# EAGLE design AtMEGA32u4-uSD-AddON-v01 (EAGLE 5.11)
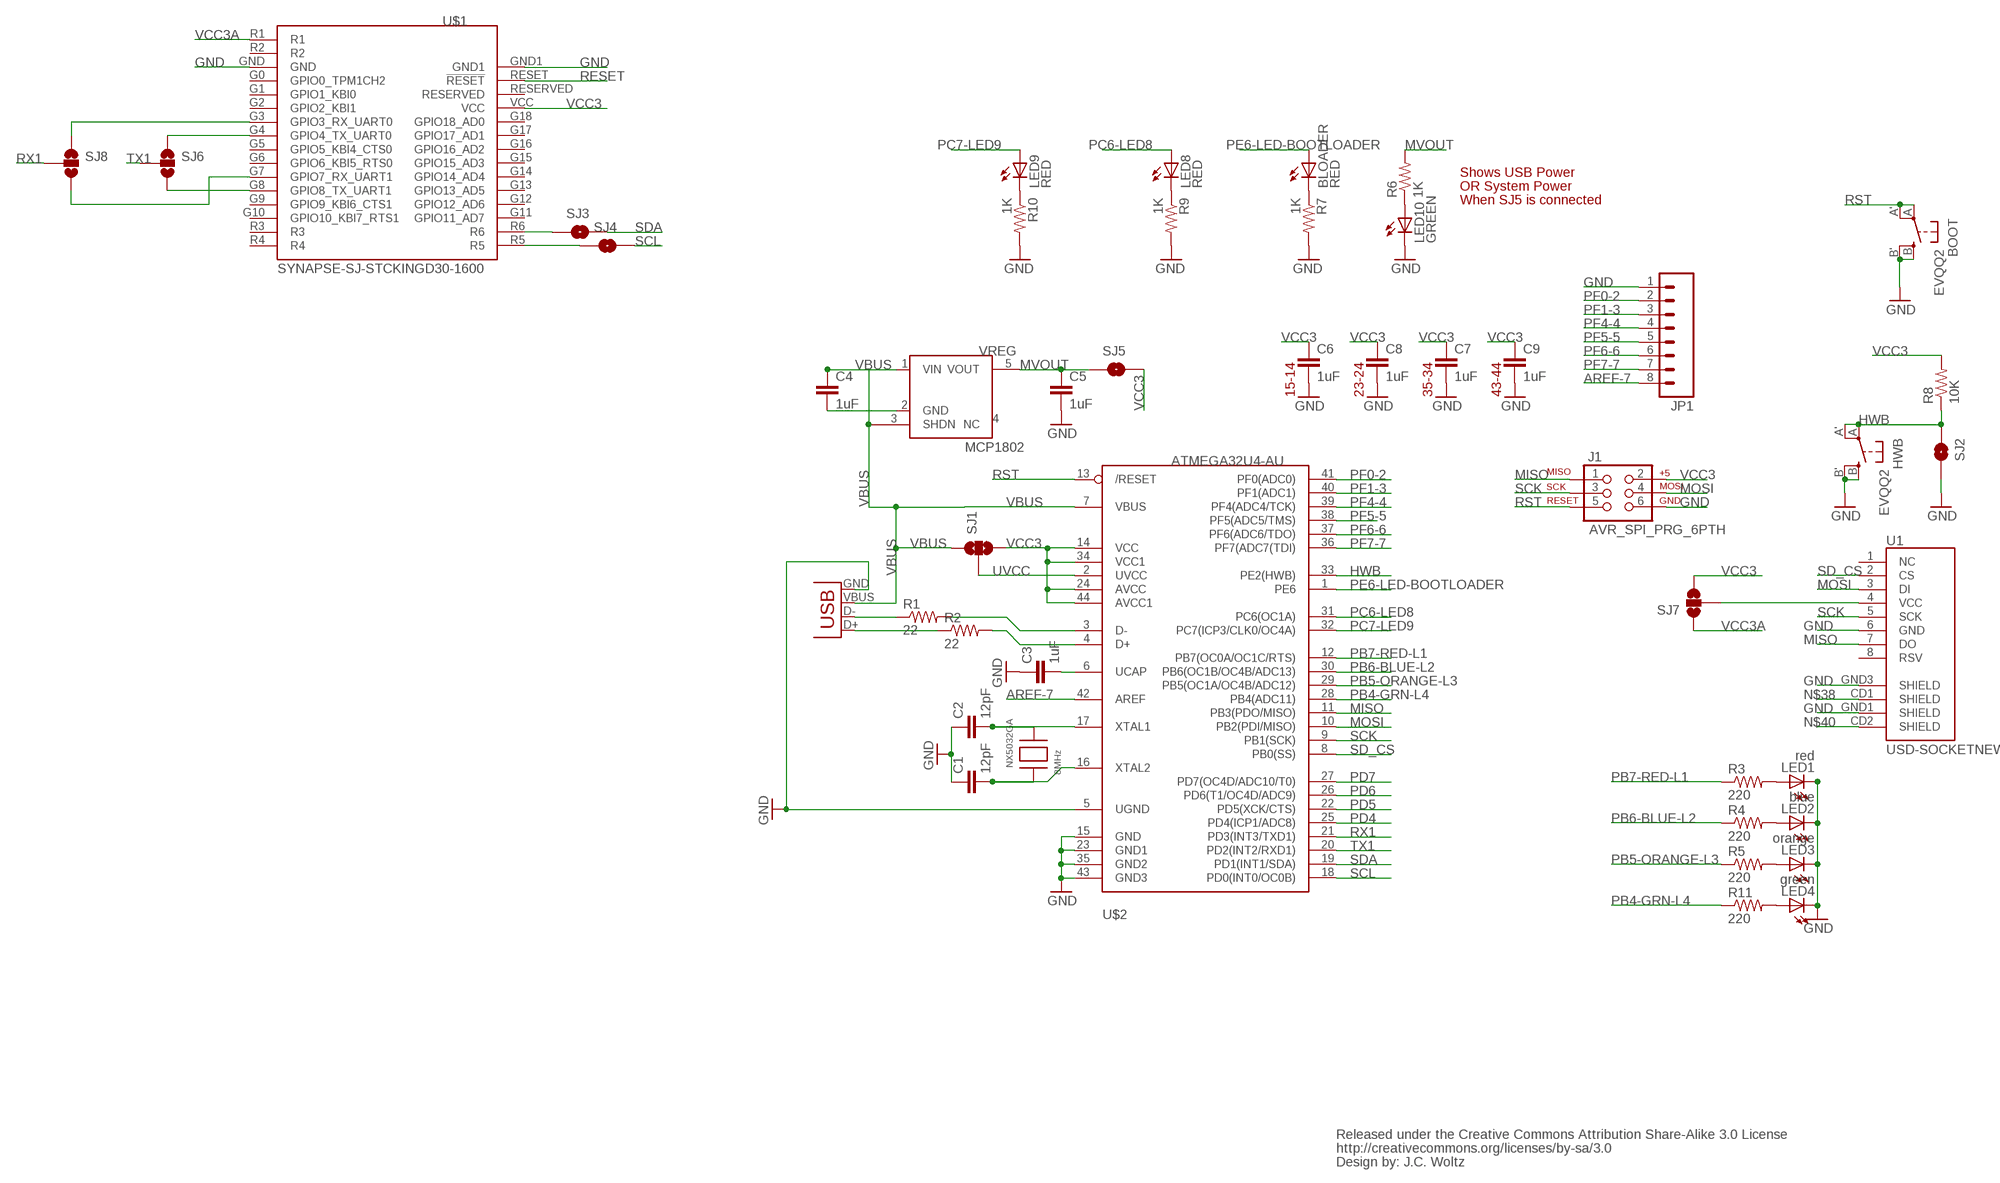
[diagram p0: schematic, sheet 1]

## Parts
BLOADER  RED  LED0603  [LED-0603]
BOOT  EVQQ2  [EVQ-Q2]
C1  12pF  CAP0603-CAP  [0603-CAP]
C2  12pF  CAP0603-CAP  [0603-CAP]
C3  1uF  CAP0603-CAP  [0603-CAP]
C4  1uF  CAP0603-CAP  [0603-CAP]
C5  1uF  CAP0603-CAP  [0603-CAP]
C6  1uF  CAP0603-CAP  [0603-CAP]
C7  1uF  CAP0603-CAP  [0603-CAP]
C8  1uF  CAP0603-CAP  [0603-CAP]
C9  1uF  CAP0603-CAP  [0603-CAP]
HWB  EVQQ2  [EVQ-Q2]
J1  AVR_SPI_PRG_6PTH  [2X3]
JP1  M08  [1X08]
LED1  red  LED0603  [LED-0603]
LED2  blue  LED0603  [LED-0603]
LED3  orange  LED0603  [LED-0603]
LED4  green  LED0603  [LED-0603]
LED8  RED  LED0603  [LED-0603]
LED9  RED  LED0603  [LED-0603]
LED10  GREEN  LED0603  [LED-0603]
NX5032GA  8MHz  XTALNX5032  [NX5032]
R1  22  RESISTOR0603-RES  [0603-RES]
R2  22  RESISTOR0603-RES  [0603-RES]
R3  220  RESISTOR0603-RES  [0603-RES]
R4  220  RESISTOR0603-RES  [0603-RES]
R5  220  RESISTOR0603-RES  [0603-RES]
R6  1K  RESISTOR0603-RES  [0603-RES]
R7  1K  RESISTOR0603-RES  [0603-RES]
R8  10K  RESISTOR0603-RES  [0603-RES]
R9  1K  RESISTOR0603-RES  [0603-RES]
R10  1K  RESISTOR0603-RES  [0603-RES]
R11  220  RESISTOR0603-RES  [0603-RES]
SJ1  SOLDERJUMPER_2WAYPASTE2&3  [SJ_3_PASTE2&3]
SJ2  HWB  SOLDERJUMPERNO  [SJ_2S-NO]
SJ3  SOLDERJUMPERNO  [SJ_2S-NO]
SJ4  SOLDERJUMPERNO  [SJ_2S-NO]
SJ5  SOLDERJUMPERNO  [SJ_2S-NO]
SJ6  SOLDERJUMPER_2WAYPASTE1&2  [SJ_3_PASTE1&2]
SJ7  SOLDERJUMPER_2WAYPASTE1&2  [SJ_3_PASTE1&2]
SJ8  SOLDERJUMPER_2WAYPASTE1&2  [SJ_3_PASTE1&2]
U1  USD-SOCKETNEW  [MICRO-SD-SOCKET-PP]
U$1  SYNAPSE-SJ-STCKINGD30-1600  [SYNSJ-STACK]
U$2  ATMEGA32U4-AU  [TQFP44]
U$5  CREATIVE_COMMONS  [CREATIVE_COMMONS]
VREG  MCP1802  [SOT23-5]
X1  USBSMD  USBH2959CT-ND  [USB-MINIB]

## Nets
AREF-7: JP1.8 U$2.42(AREF)
GND: BOOT.B'(S1) BOOT.B(S) C1.1 C2.1 C3.1 C4.2 C5.2 C6.2 C7.2 C8.2 C9.2 HWB.B'(S1) HWB.B(S) J1.6 JP1.1 LED1.C LED2.C LED3.C LED4.C LED10.C R7.2 R9.2 R10.2 SJ2.2 U1.6(GND) U1.GND1(SHIELD) U1.GND3(SHIELD) U$1.GND U$1.GND1 U$2.5(UGND) U$2.15(GND) U$2.23(GND1) U$2.35(GND2) U$2.43(GND3) VREG.2(GND) X1.GND
HWB [smallsignal]: HWB.A'(P1) HWB.A(P) R8.1 SJ2.1 U$2.33(PE2(HWB))
MISO: J1.1 U1.7(DO) U$2.11(PB3(PDO/MISO))
MOSI: J1.4 U1.3(DI) U$2.10(PB2(PDI/MISO))
MVOUT: C5.1 R6.2 SJ5.1 VREG.5(VOUT)
N$1: LED9.C R10.1
N$2: LED1.A R3.2
N$3: SJ7.2 U1.4(VCC)
N$4: C3.2 U$2.6(UCAP)
N$5: LED4.A R11.2
N$7: LED2.A R4.2
N$8: LED10.A R6.1
N$9: LED8.C R9.1
N$10: BLOADER.C R7.1
N$11: SJ3.1 U$1.R6
N$12: LED3.A R5.2
N$13: SJ4.1 U$1.R5
N$14: SJ8.1 U$1.G3(GPIO3_RX_UART0)
N$15: SJ6.1 U$1.G4(GPIO4_TX_UART0)
N$16: SJ8.3 U$1.G7(GPIO7_RX_UART1)
N$17: SJ6.3 U$1.G8(GPIO8_TX_UART1)
N$38: U1.CD1(SHIELD)
N$40: U1.CD2(SHIELD)
PB4-GRN-L4: R11.1 U$2.28(PB4(ADC11))
PB5-ORANGE-L3: R5.1 U$2.29(PB5(OC1A/OC4B/ADC12))
PB6-BLUE-L2: R4.1 U$2.30(PB6(OC1B/OC4B/ADC13))
PB7-RED-L1: R3.1 U$2.12(PB7(OC0A/OC1C/RTS))
PC6-LED8: LED8.A U$2.31(PC6(OC1A))
PC7-LED9: LED9.A U$2.32(PC7(ICP3/CLK0/OC4A))
PD4: U$2.25(PD4(ICP1/ADC8))
PD5: U$2.22(PD5(XCK/CTS))
PD6: U$2.26(PD6(T1/OC4D/ADC9))
PD7: U$2.27(PD7(OC4D/ADC10/T0))
PE6-LED-BOOTLOADER: BLOADER.A U$2.1(PE6)
PF0-2: JP1.2 U$2.41(PF0(ADC0))
PF1-3: JP1.3 U$2.40(PF1(ADC1))
PF4-4: JP1.4 U$2.39(PF4(ADC4/TCK))
PF5-5: JP1.5 U$2.38(PF5(ADC5/TMS))
PF6-6: JP1.6 U$2.37(PF6(ADC6/TDO))
PF7-7: JP1.7 U$2.36(PF7(ADC7(TDI))
RESET: U$1.RESET(!RESET)
RST [smallsignal]: BOOT.A'(P1) BOOT.A(P) J1.5 U$2.13(/RESET)
RX1: SJ8.2 U$2.21(PD3(INT3/TXD1))
SCK: J1.3 U1.5(SCK) U$2.9(PB1(SCK))
SCL: SJ4.2 U$2.18(PD0(INT0/OC0B))
SD_CS: U1.2(CS) U$2.8(PB0(SS))
SDA: SJ3.2 U$2.19(PD1(INT1/SDA))
TX1: SJ6.2 U$2.20(PD2(INT2/RXD1))
UD+: R2.2 U$2.4(D+)
UD-: R1.2 U$2.3(D-)
UDM: R1.1 X1.D-
UDP: R2.1 X1.D+
UVCC: SJ1.2 U$2.2(UVCC)
VBUS: C4.1 SJ1.1 U$2.7(VBUS) VREG.1(VIN) VREG.3(SHDN) X1.VBUS
VCC3: C6.1 C7.1 C8.1 C9.1 J1.2 R8.2 SJ1.3 SJ5.2 SJ7.3 U$1.VCC U$2.14(VCC) U$2.24(AVCC) U$2.34(VCC1) U$2.44(AVCC1)
VCC3A: SJ7.1 U$1.R1
XTAL1: C2.2 NX5032GA.P$2 U$2.17(XTAL1)
XTAL2: C1.2 NX5032GA.P$1 U$2.16(XTAL2)
Unconnected: U1.1(NC) U1.8(RSV) U$1.G0(GPIO0_TPM1CH2) U$1.G1(GPIO1_KBI0) U$1.G2(GPIO2_KBI1) U$1.G5(GPIO5_KBI4_CTS0) U$1.G6(GPIO6_KBI5_RTS0) U$1.G9(GPIO9_KBI6_CTS1) U$1.G10(GPIO10_KBI7_RTS1) U$1.G11(GPIO11_AD7) U$1.G12(GPIO12_AD6) U$1.G13(GPIO13_AD5) U$1.G14(GPIO14_AD4) U$1.G15(GPIO15_AD3) U$1.G16(GPIO16_AD2) U$1.G17(GPIO17_AD1) U$1.G18(GPIO18_AD0) U$1.R2 U$1.R3 U$1.R4 U$1.RESERVED VREG.4(NC)

## Notes on the sheet
- Shows USB Power
- OR System Power
- When SJ5 is connected
- 15-14 | 23-24 | 35-34 | 43-44

## Library data of the parts
BLOADER LED1-LED4 LED8-LED10 = 0_jc-custom:LED: LEDs Standard schematic elements and footprints for 5mm, 3mm, 1206, and 0603 sized LEDs. 5mm - Spark Fun Electronics SKU : COM-00529 (and others)
BOOT HWB = adaprog:EVQQ2
C1 C2 = SparkFun:CAP: Capacitor Standard 0603 ceramic capacitor, and 0.1" leaded capacitor.
C3-C9 = 0_jc-custom:CAP: Capacitor Standard 0603 ceramic capacitor, and 0.1" leaded capacitor.
J1 = SparkFun:AVR_SPI_PRG_6: AVR ISP 6 Pin This is the reduced ISP connector for AVR programming. Common on Arduino. This footprint will take up less PCB space and can be used with a 10-pin to 6-pin adapter such as SKU: BOB-08508
JP1 = SparkFun:M08: Header 8 Standard 8-pin 0.1" header. Use with straight break away headers (SKU : PRT-00116), right angle break away headers (PRT-00553), swiss pins (PRT-00743), machine pins (PRT-00117), and female headers (PRT-00115).
NX5032GA = adafruit:XTAL: Low cost SMT crystals, no capacitors included http://www.ladyada.net/library/eagle
R1-R11 = 0_jc-custom:RESISTOR
SJ1 SJ6-SJ8 = SparkFun:SOLDERJUMPER_2WAY: Solder Jumper 2 way solder jumper
SJ2-SJ5 = SparkFun:SOLDERJUMPER: Solder Jumper Standard SMD solder jumper. Used to automate production. Two varients : Normally Open and Normally Closed are the same, but have different paste layers. NC will have a large amount of paste and should jumper during reflow.
U1 = 0_jc-modified:USD-SOCKET: microSD Socket Push-push type uSD socket. Schematic element and footprint production proven. Spark Fun Electronics SKU : PRT-00127. tDoc lines correctly indicate media card edge positions when inserting (unlocked, locked, depressed).
U$1 = 0_jc-custom:SYNAPSE-SJ-STCKING: Standard layout for expansion modules using Synapse Wireless boards
U$2 = adafruit:ATMEGA32U4: http://www.ladyada.net/library/eagle
U$5 = 0_jc-custom:CREATIVE_COMMONS
VREG = 0_jc-custom:MCP1802
X1 = 0_jc-custom:USB: USB Connectors Fully proven 670-1190-1-ND http://search.digikey.com/scripts/DkSearch/dksus.dll?Detail&name=670-1190-1-ND

## Net classes
0 default: width 0.203 mm
1 smallsignal: width 0.152 mm
2 bigsignal: width 0.356 mm

## Board
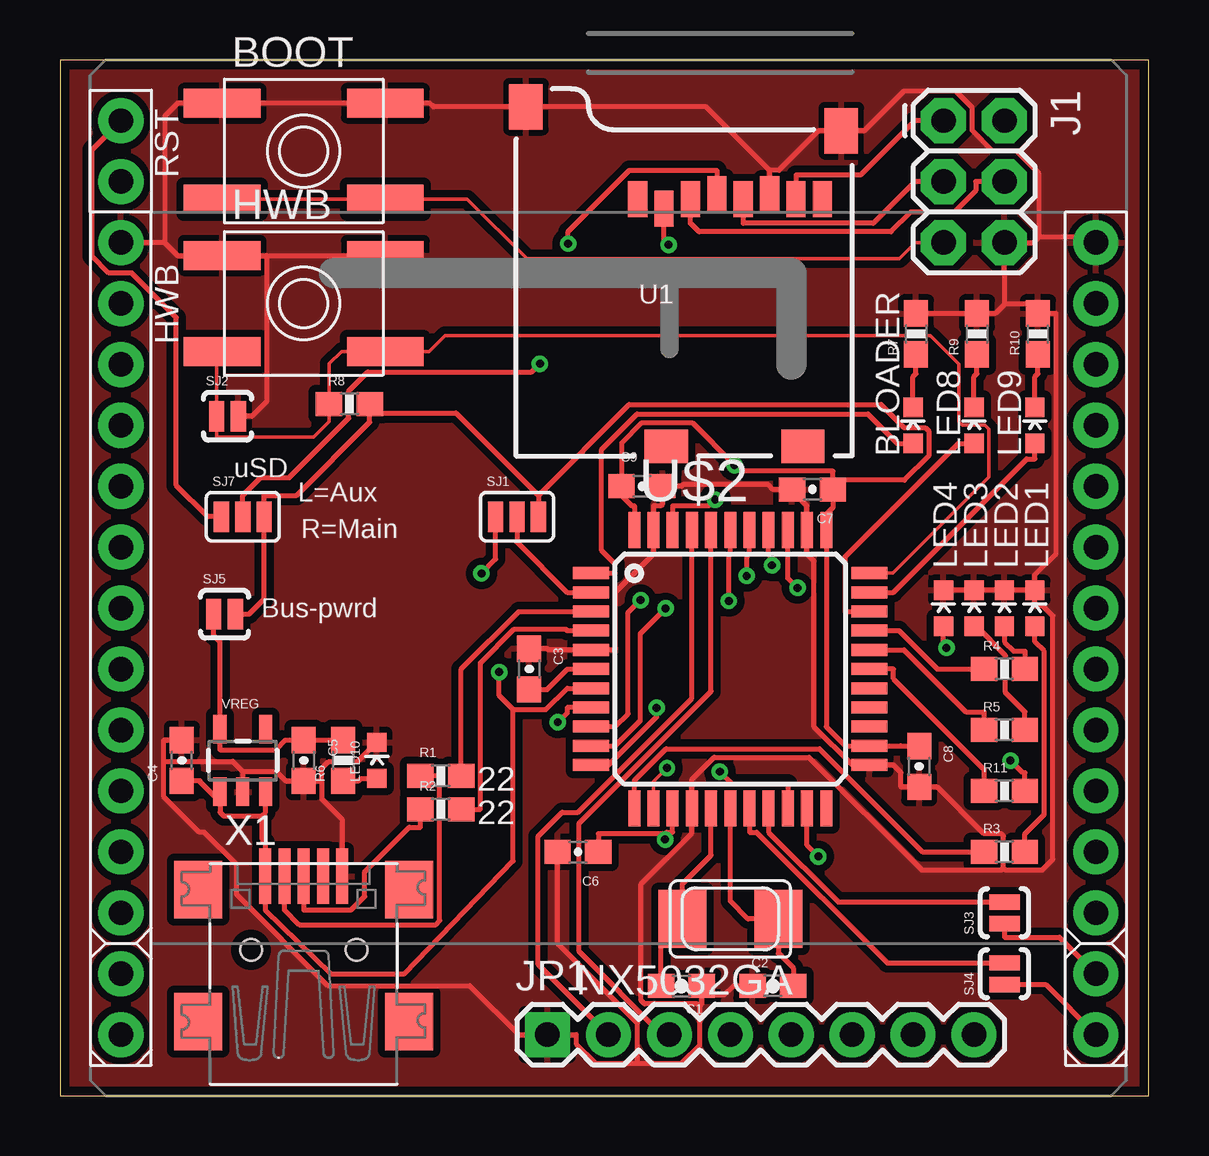
[diagram p1: board, top side]
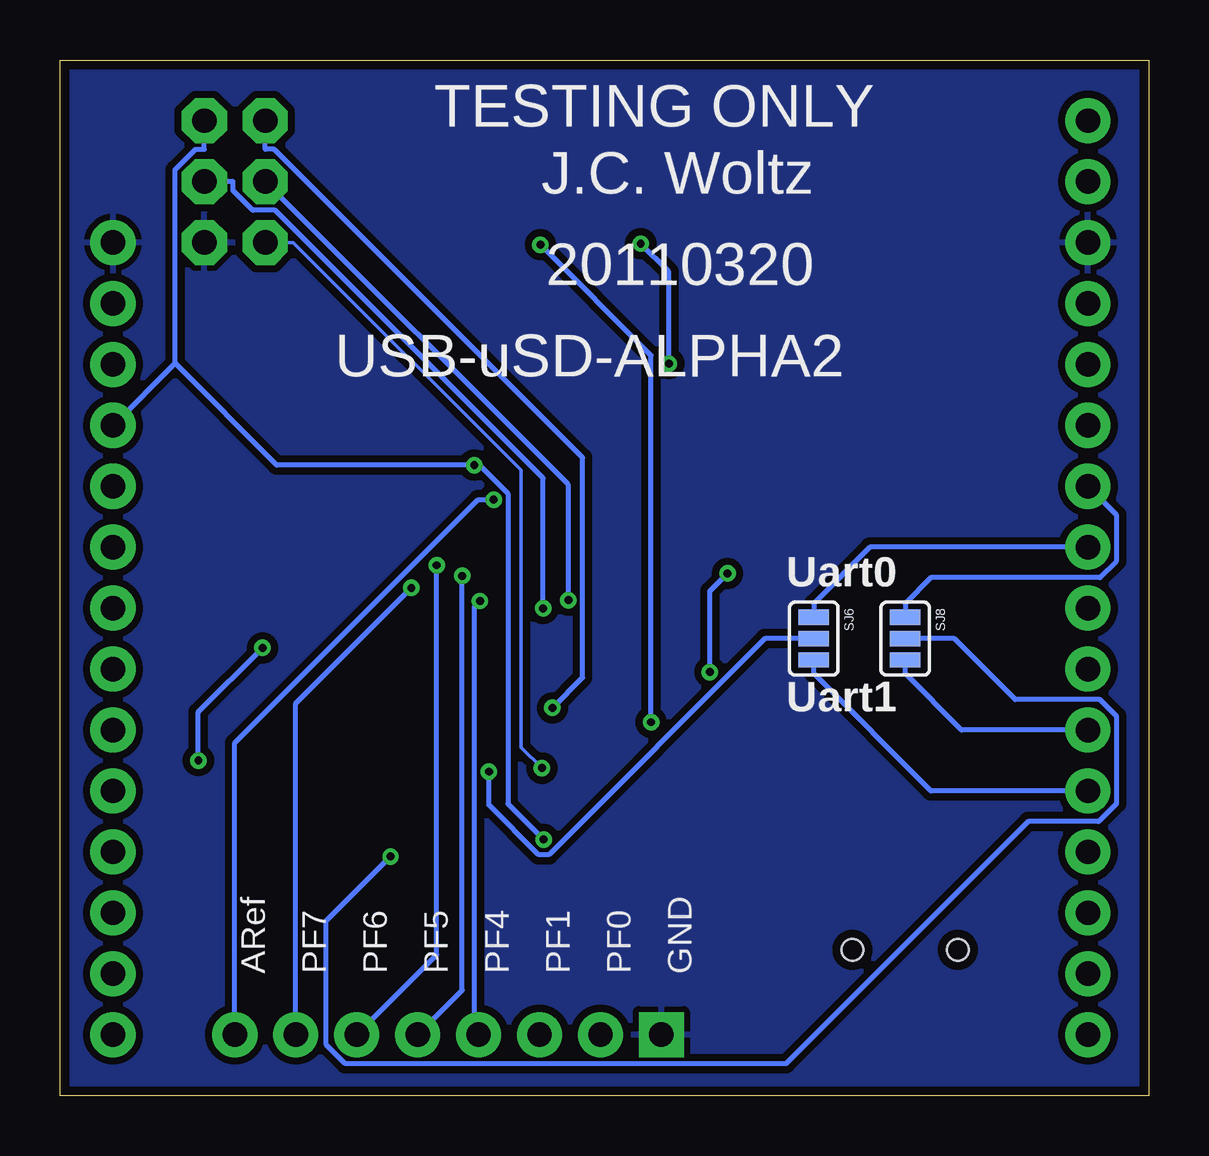
[diagram p2: board, bottom side, seen from below]

Size 45.39 x 43.17 mm. Coordinates in mm from the lower left corner, seen from the top.
Outline: 0,0 45.39,0 45.39,43.17 0,43.17 0,0
Copper layers (1*16): Top 0.0356mm / dielectric 1.5011mm / Bottom 0.0356mm
Design rules "LaenPCBOrder-JCModified": minimum track width 6mil, minimum drill 13mil, track to track 6mil, track to pad 6mil, pad to pad 6mil, via to via 6mil, smd to smd 6mil, copper to edge 15mil, drill to drill 6mil, minimum pad ring 12mil, minimum via ring 7mil, stop-mask expansion 4mil, vias tented up to drill 25mil, thermal gap 10mil

### Footprints (pad centres in the part's own frame; a part is rotated, then mirrored left to right if it is on the bottom)
LED-0603 = smd 0.8 x 0.8: A 0,-0.75; C 0,0.75
EVQ-Q2 = smd 3.2 x 1.2: A -3.4,-2; A' 3.4,-2; B -3.4,2; B' 3.4,2
0603-CAP = smd 1.1 x 1: 1 -0.85,0; 2 0.85,0
2X3 = drill 1.016 pad 1.88 octagon: 1 0,0; 2 0,2.54; 3 2.54,0; 4 2.54,2.54; 5 5.08,0; 6 5.08,2.54
1X08 = drill 1.016 pad 1.88 square: 1 0,0 | drill 1.016 pad 1.88 round: 2 2.54,0; 3 5.08,0; 4 7.62,0; 5 10.16,0; 6 12.7,0; 7 15.24,0; 8 17.78,0
NX5032 = smd 2 x 2.4: P$1 2,0; P$2 -2,0
0603-RES = smd 1.1 x 1: 1 -0.85,0; 2 0.85,0
SJ_3_PASTE2&3 = smd 0.635 x 1.27: 1 -0.889,0; 2 0,0; 3 0.889,0
SJ_2S-NO = smd 0.635 x 1.27: 1 -0.45,0; 2 0.45,0
SJ_3_PASTE1&2 = smd 0.635 x 1.27: 1 -0.889,0; 2 0,0; 3 0.889,0
MICRO-SD-SOCKET-PP = smd 0.8 x 1.5: 1 -8.94,10.7; 2 -7.84,10.3; 3 -6.74,10.7; 4 -5.64,10.9; 5 -4.54,10.7; 6 -3.44,10.9; 7 -2.34,10.7; 8 -1.24,10.7 | smd 1.8 x 1.4: CD1 -2.05,0.4; CD2 -7.75,0.4 | smd 1.4 x 1.9: GND1 -13.6,14.55; GND3 -0.45,13.55
SYNSJ-STACK = drill 1.016 pad 1.88 round: G0 0,-7.62; G1 0,-10.16; G2 0,-12.7; G3 0,-15.24; G4 0,-17.78; G5 0,-20.32; G6 0,-22.86; G7 0,-25.4; G8 0,-27.94; G9 0,-30.48; G10 0,-33.02; G11 40.64,-33.02; G12 40.64,-30.48; G13 40.64,-27.94; G14 40.64,-25.4; G15 40.64,-22.86; G16 40.64,-20.32; G17 40.64,-17.78; G18 40.64,-15.24; GND 0,-5.08; GND1 40.64,-5.08; R1 0,0; R2 0,-2.54; R3 0,-35.56; R4 0,-38.1; R5 40.64,-38.1; R6 40.64,-35.56; RESERVED 40.64,-10.16; RESET 40.64,-7.62; VCC 40.64,-12.7
TQFP44 = smd 1.5 x 0.5: 1 -5.8,4; 2 -5.8,3.2; 3 -5.8,2.4; 4 -5.8,1.6; 5 -5.8,0.8; 6 -5.8,0; 7 -5.8,-0.8; 8 -5.8,-1.6; 9 -5.8,-2.4; 10 -5.8,-3.2; 11 -5.8,-4; 23 5.8,-4; 24 5.8,-3.2; 25 5.8,-2.4; 26 5.8,-1.6; 27 5.8,-0.8; 28 5.8,0; 29 5.8,0.8; 30 5.8,1.6; 31 5.8,2.4; 32 5.8,3.2; 33 5.8,4 | smd 0.5 x 1.5: 12 -4,-5.8; 13 -3.2,-5.8; 14 -2.4,-5.8; 15 -1.6,-5.8; 16 -0.8,-5.8; 17 0,-5.8; 18 0.8,-5.8; 19 1.6,-5.8; 20 2.4,-5.8; 21 3.2,-5.8; 22 4,-5.8; 34 4,5.8; 35 3.2,5.8; 36 2.4,5.8; 37 1.6,5.8; 38 0.8,5.8; 39 0,5.8; 40 -0.8,5.8; 41 -1.6,5.8; 42 -2.4,5.8; 43 -3.2,5.8; 44 -4,5.8
SOT23-5 = smd 0.55 x 1.2: 1 -0.95,-1.3; 2 0,-1.3; 3 0.95,-1.3; 4 0.95,1.3; 5 -0.95,1.3
USB-MINIB = smd 0.5 x 2.308: D+ 0,4.064; D- -0.8,4.064; GND 1.6,4.064; ID 0.8,4.064; VBUS -1.6,4.064 | smd 2 x 2.4: GND1 -4.4,-2; GND2 -4.4,3.5; GND3 4.4,3.5; GND4 4.4,-2 | hole 0.9: -2.2,1; 2.2,1

### Placement (x,y rotation side)
BLOADER  35.56,27.94 0 top
BOOT  10.16,39.37 0 top
C1  25.91,4.57 180 top
C2  29.72,4.57 0 top
C3  19.56,17.78 270 top
C4  5.08,13.97 90 top
C5  10.16,13.97 270 top
C6  21.59,10.16 180 top
C7  31.37,25.27 180 top
C8  35.81,13.72 270 top
C9  24.26,25.4 0 top
HWB  10.16,33.02 0 top
J1  36.83,40.64 270 top
JP1  20.32,2.54 0 top
LED1  40.64,20.32 0 top
LED2  39.37,20.32 0 top
LED3  38.1,20.32 0 top
LED4  36.83,20.32 0 top
LED8  38.1,27.94 0 top
LED9  40.64,27.94 0 top
LED10  13.21,13.97 0 top
NX5032GA  27.94,7.37 180 top
R1  15.88,13.33 0 top
R2  15.88,11.94 0 top
R3  39.37,10.16 0 top
R4  39.37,17.78 0 top
R5  39.37,15.24 0 top
R6  11.81,13.97 90 top
R7  35.69,31.75 90 top
R8  12.06,28.83 0 top
R9  38.23,31.75 90 top
R10  40.77,31.75 90 top
R11  39.37,12.7 0 top
SJ1  19.05,24.13 0 top
SJ2  6.99,28.32 0 top
SJ3  39.37,7.62 90 top
SJ4  39.37,5.08 90 top
SJ5  6.86,20.07 0 top
SJ6  13.97,19.05 270 bottom
SJ7  7.62,24.13 0 top
SJ8  10.16,19.05 270 bottom
U1  33.02,26.67 0 top
U$1  2.54,40.64 0 top
U$2  27.94,17.78 0 top
U$5  3.81,-8.89 0 top  (outside the outline)
VREG  7.62,13.97 0 top
X1  10.16,5.08 0 top

### Tracks (layer width: path | path; a pad name or v marks a point on that pad's centre or on a via)
AREF-7  (via drill 0.33 pad 0.69)
  Top 0.203: U$2.42 25.54,24.58 27.05,24.58 v27.31,24.84
  Bottom 0.203: v27.31,24.84 27.96,24.84 38.1,14.7 JP1.8
GND
  Top 0.203: LED1.C 40.64,20.42 40.97,20.42 41.39,20 41.39,9.85 40.94,9.41 39.41,9.41 39.32,9.49 | LED1.C 40.64,21.72 41.52,22.6 41.52,32.6 R10.2 40.77,33 39.38,33 | 39.38,33 38.98,32.6 R9.2 R7.2 | 39.38,33 39.38,34.35 39.37,34.37 J1.6 40.56,35.56 40.82,35.81 | 24.07,1.34 25.9,1.34 26.67,2.11 26.67,3.73 | 24.07,1.34 22.34,1.34 21.51,2.17 21.51,2.54 JP1.1 19.13,2.54 17.08,4.58 11.16,4.58 7.36,8.39 7.36,9.64 6.01,10.98 5.8,10.98 4.33,12.46 4.33,13.94 | 24.07,1.34 24.07,3.02 20.74,6.35 C6.2 | 26.67,3.73 26.58,3.82 24.37,3.82 24.22,3.97 24.22,8.82 26.34,10.94 U$2.15 26.34,13.18 27.26,14.1 31.22,14.1 35.92,9.41 39.24,9.41 39.32,9.49 | 26.67,3.73 26.76,3.82 26.76,4.2 | 26.76,4.2 C1.1 | U$1.GND1 42.93,35.81 40.82,35.81 | 40.82,35.81 40.82,38.43 39.88,39.37 38.89,39.37 38.02,40.23 38.02,41.18 37.34,41.87 35.17,41.87 33.52,40.22 U1.GND3 31.62,40.22 29.97,38.57 29.58,38.57 | 39.32,9.49 39.32,10.82 39.23,10.91 38.52,10.91 36.57,12.87 C8.2 35.06,12.87 35.06,13.46 34.74,13.78 U$2.23 33.03,13.78 31.44,15.38 31.44,22.28 31.14,22.58 U$2.35 31.14,24.58 30.52,25.2 C7.2 29.71,25.27 29.52,25.47 25.98,25.47 25.91,25.4 C9.2 25.11,24.65 25.04,24.58 24.74,24.58 U$2.43 24.74,22.58 23.14,20.98 23.14,18.58 U$2.5 20.36,18.58 20.31,18.63 C3.1 | 10.91,13.12 10.91,13.63 11.21,13.92 12.41,13.92 LED10.C | LED1.C LED2.C LED3.C LED4.C | 29.58,38.57 26.93,41.22 U1.GND1 15.56,41.22 15.41,41.37 BOOT.B' BOOT.B 4.91,41.37 4.37,40.83 4.37,35.56 | 29.58,38.57 U1.6 | C2.1 28.06,4.57 27.69,4.2 26.76,4.2 | 4.33,13.94 4.33,14.82 C4.2 | 4.33,13.94 7.2,13.94 7.62,13.52 | 7.62,13.52 VREG.2 | 7.62,13.52 9,13.52 9.41,13.12 C5.2 10.91,13.12
  Top 0.203: X1.GND 11.76,11.52 10.91,12.37 10.91,13.12 | 4.37,35.56 4.91,35.02 HWB.B 8.61,35.02 | 4.37,35.56 U$1.GND | 8.61,35.02 HWB.B' | SJ2.2 8.01,28.32 8.61,28.93 8.61,35.02
  pour Bottom (isolate 0.305): 0,45.72 45.72,45.72 45.72,0 0,0
  pour Top (isolate 0.305): 0,45.72 45.72,45.72 45.72,0 0,0
HWB
  Top 0.152: U$2.33 34.72,21.78 38.73,25.79 38.73,27.77 38.56,27.95 37.61,27.95 37.47,28.08 37.47,30.5 36.29,31.68 16.05,31.68 15.39,31.02 HWB.A' 11.73,31.02 11.21,30.5 11.21,29.56 R8.1 11.21,28.1 10.57,27.46 6.53,27.46 SJ2.1 6.53,30.8 HWB.A
MISO  (via drill 0.33 pad 0.69)
  Top 0.203: v24.87,16.16 24.87,15.78 22.87,13.78 U$2.11 | J1.1 35.64,40.64 33.37,38.37 30.68,38.37 U1.7
  Bottom 0.203: J1.1 36.83,39.45 36.46,39.45 23.6,26.59 23.6,17.42 v24.87,16.16
MOSI  (via drill 0.33 pad 0.69)
  Top 0.203: U$2.10 23.14,14.58 24.2,15.63 24.2,19.26 v25.25,20.31 | J1.4 38.18,38.1 38.18,37.73 37.28,36.83 35.46,36.83 34.64,36.01 26.64,36.01 26.28,36.37 U1.3
  Bottom 0.203: J1.4 38.18,38.1 38.18,37.73 37.36,36.91 36.41,36.91 25.25,25.74 v25.25,20.31
MVOUT
  Top 0.203: SJ5.1 6.41,19.18 6.67,18.91 VREG.5 6.67,14.42 9,14.42 9.41,14.82 C5.1 R6.2
N$1
  Top 0.203: R10.1 40.77,30.1 40.64,29.97 LED9.C
N$2
  Top 0.203: LED1.A 40.64,18.92 41.02,18.53 41.02,11.72 40.22,10.91 R3.2
N$3  (via drill 0.33 pad 0.69)
  Top 0.203: U1.4 27.38,38.57 23.73,38.57 21.18,36.02 v21.18,35.51 | SJ7.2 7.62,25.02 8.36,25.76 9.56,25.76 12.03,28.23 12.03,29.37 12.83,30.17 19.67,30.17 v20.01,30.51
  Bottom 0.203: v21.18,35.51 20.01,34.34 v20.01,30.51
N$4
  Top 0.203: U$2.6 21.14,17.78 21.14,17.75 20.31,16.93 C3.2
N$5  (via drill 0.33 pad 0.69)
  Top 0.203: R11.2 40.22,13.45 40.14,13.45 v39.62,13.97 | v36.95,18.67 36.83,18.78 LED4.A
  Bottom 0.203: v39.62,13.97 39.62,15.99 v36.95,18.67
N$7
  Top 0.203: R4.2 40.22,18.53 39.75,18.53 39.37,18.92 LED2.A
N$8
  Top 0.203: LED10.A 12.55,13.22 12.45,13.12 R6.1
N$9
  Top 0.203: R9.1 38.23,30.1 38.1,29.97 LED8.C
N$10
  Top 0.203: R7.1 35.69,30.1 35.56,29.97 BLOADER.C
N$11
  Top 0.203: SJ3.1 39.37,6.6 41.66,6.6 U$1.R6
N$12
  Top 0.203: R5.2 40.22,15.99 39.42,16.8 39.42,18.34 38.19,19.57 LED3.A
N$13
  Top 0.203: U$1.R5 41.09,4.63 SJ4.1
N$14
  Bottom 0.203: SJ8.1 10.16,20.51 9.08,21.59 2.04,21.59 1.34,22.29 1.34,24.2 U$1.G3
N$15
  Bottom 0.203: SJ6.1 13.97,20.51 11.62,22.86 U$1.G4
N$16
  Bottom 0.203: SJ8.3 10.16,17.59 7.81,15.24 U$1.G7
N$17
  Bottom 0.203: SJ6.3 13.97,17.59 9.08,12.7 U$1.G8
PB4-GRN-L4
  Top 0.203: U$2.28 34.74,17.78 34.74,17.38 38.52,13.6 R11.1
PB5-ORANGE-L3
  Top 0.203: R5.1 38.52,15.99 37.77,15.99 35.18,18.58 U$2.29
PB6-BLUE-L2
  Top 0.203: U$2.30 34.97,19.38 36.57,17.78 R4.1
PB7-RED-L1
  Top 0.203: R3.1 35.96,10.16 31.66,14.46 25.26,14.46 23.94,13.13 23.94,12.98 U$2.12
PC6-LED8
  Top 0.203: LED8.A 37.45,27.19 32.74,22.48 32.74,20.18 U$2.31
PC7-LED9
  Top 0.203: LED9.A 40.64,26.54 40.3,26.54 34.74,20.98 U$2.32
PE6-LED-BOOTLOADER
  Top 0.203: BLOADER.A 34.91,27.19 33.69,28.41 24.05,28.41 22.58,26.94 22.58,22.72 23.14,22.16 23.14,21.78 U$2.1
PF0-2
  Top 0.203: U$2.41 26.34,16.56 21.59,11.81 20.94,11.81 19.93,10.81 19.93,5.47 JP1.2
PF1-3
  Top 0.203: U$2.40 27.14,16.85 21.64,11.35 21.64,6 25.1,2.54 JP1.3
PF4-4  (via drill 0.33 pad 0.69)
  Top 0.203: U$2.39 27.94,22.58 27.88,22.52 v27.88,20.62
  Bottom 0.203: v27.88,20.62 28.11,20.38 28.11,2.71 JP1.4
PF5-5  (via drill 0.33 pad 0.69)
  Top 0.203: U$2.38 28.74,22.58 28.62,22.46 v28.62,21.66
  Bottom 0.203: v28.62,21.66 28.62,4.39 JP1.5
PF6-6  (via drill 0.33 pad 0.69)
  Top 0.203: U$2.37 29.54,22.58 29.68,22.43 v29.68,22.11
  Bottom 0.203: v29.68,22.11 29.68,5.88 JP1.6
PF7-7  (via drill 0.33 pad 0.69)
  Top 0.203: U$2.36 30.34,21.57 v30.74,21.16
  Bottom 0.203: v30.74,21.16 35.56,16.35 JP1.7
RST  (via drill 0.33 pad 0.69)
  Top 0.152: v25.3,13.65 24.74,13.09 U$2.13 | J1.5 35.66,35.56 34.98,34.88 19.46,34.88 16.97,37.37 BOOT.A' BOOT.A
  Bottom 0.152: J1.5 35.66,35.56 26.17,26.07 26.17,14.52 v25.3,13.65
RX1  (via drill 0.33 pad 0.69)
  Top 0.203: U$2.21 31.14,10.43 v31.61,9.96
  Bottom 0.203: v31.61,9.96 34.29,7.28 34.29,2.12 33.5,1.33 15.12,1.33 5.03,11.43 2.09,11.43 1.34,12.18 1.34,15.81 2.04,16.51 5.58,16.51 8.12,19.05 SJ8.2
SCK  (via drill 0.33 pad 0.69)
  Top 0.203: U$2.9 23.14,15.38 23.68,15.92 23.68,20.14 v24.2,20.66 | J1.3 35.64,38.1 33.9,36.37 28.48,36.37 U1.5
  Bottom 0.203: J1.3 24.2,25.47 v24.2,20.66
SCL
  Top 0.203: U$2.18 28.74,10.98 29.04,10.98 34.48,5.53 SJ4.2
SD_CS  (via drill 0.33 pad 0.69)
  Top 0.203: U$2.8 21.14,16.18 21.14,15.95 v20.75,15.56 | U1.2 25.18,35.65 v25.37,35.47
  Bottom 0.203: v25.37,35.47 20.75,30.85 v20.75,15.56
SDA
  Top 0.203: SJ3.2 32.45,8.07 29.54,10.98 U$2.19
TX1  (via drill 0.33 pad 0.69)
  Top 0.203: U$2.20 30.34,12.98 28.03,12.98 v27.51,13.5
  Bottom 0.203: v27.51,13.5 27.51,12.11 25.44,10.04 25.01,10.04 16,19.05 SJ6.2
UD+
  Top 0.203: U$2.4 21.14,19.38 21.07,19.44 18.93,19.44 17.53,18.04 17.53,11.94 R2.2
UD-
  Top 0.203: R1.2 16.72,17.78 19.12,20.18 U$2.3
UDM
  Top 0.203: R1.1 15.83,13.33 15.83,7.29 15.67,7.13 9.97,7.13 9.36,7.74 X1.D-
UDP
  Top 0.203: X1.D+ 10.16,7.74 12.13,7.74 12.7,8.3 12.7,9.33 14.55,11.18 15.02,11.18 R2.1
UVCC
  Top 0.203: U$2.2 21.14,20.98 19.05,23.07 SJ1.2
VBUS  (via drill 0.33 pad 0.69)
  Top 0.203: C4.1 5.83,13.12 5.83,13.08 6.67,12.24 | 6.67,12.24 6.67,11.82 6.83,11.66 8.41,11.66 | VREG.1 6.67,12.24 | 8.41,11.66 8.41,10.7 8.56,10.55 X1.VBUS 8.56,8.91 8.56,7.74 11.3,5.08 14.37,5.08 18.9,9.78 18.9,16.09 | VREG.3 8.57,11.82 8.41,11.66 | 18.9,16.09 18.3,16.68 v18.3,17.65 | 18.9,16.09 20.24,16.09 21.14,16.98 U$2.7 | v17.57,21.77 18.16,22.36 SJ1.1
  Bottom 0.203: v17.57,21.77 18.3,21.03 v18.3,17.65
VCC3  (via drill 0.33 pad 0.69)
  Top 0.203: 25.23,10.91 22.44,10.91 C6.1 | 25.23,10.91 25.29,10.98 25.54,10.98 U$2.14 | v25.23,10.67 25.23,10.91 | 32.22,25.65 35.21,25.65 36.21,26.66 36.21,27.7 36.07,27.84 35.19,27.84 34.22,28.81 23.73,28.81 19.94,25.02 | 32.22,25.65 32.22,26.03 28.37,26.03 v28.12,26.28 26.38,28.02 24.22,28.02 23.41,27.21 C9.1 23.41,25.02 23.85,24.58 23.94,24.58 U$2.44 | 32.22,25.65 C7.1 32.22,24.52 31.94,24.24 U$2.34 31.94,15.38 32.74,14.58 U$2.24 35.05,14.58 35.06,14.57 C8.1 | 19.94,25.02 SJ1.3 | 12.91,28.45 16.51,28.45 19.94,25.02 | 12.91,28.45 12.91,28.08 9.86,25.02 8.51,25.02 SJ7.3 8.51,20.7 7.88,20.07 SJ5.2 | 12.91,28.45 R8.2
  Bottom 0.203: v25.23,10.67 26.71,12.16 26.71,25.09 27.91,26.28 v28.12,26.28 36.35,26.28 40.59,30.53 | 40.59,30.53 40.59,38.59 39.74,39.45 39.37,39.45 J1.2 | 40.59,30.53 U$1.VCC
VCC3A
  Top 0.203: SJ7.1 6.16,24.13 4.85,25.44 4.85,32.43 2.99,34.29 2.04,34.29 1.34,34.99 1.34,39.44 U$1.R1
XTAL1
  Top 0.203: U$2.17 27.94,8.11 28.69,7.37 NX5032GA.P$2 29.94,5.91 29.98,5.91 30.57,5.33 C2.2
XTAL2
  Top 0.203: 25.94,8.09 25.06,7.21 C1.2 | 25.94,8.09 25.94,8.82 27.14,10.02 U$2.16 | 25.94,8.09 NX5032GA.P$1

### Text on the board
tPlace: RST | HWB | uSD | L=Aux | R=Main | Bus-pwrd
bPlace: TESTING ONLY | J.C. Woltz | 20110320 | USB-uSD-ALPHA2 | Uart0 | Uart1 | GND | PF0 | PF1 | PF4 | PF5 | PF6 | PF7 | ARef